# EAGLE design Supplemental Power Switch System (EAGLE 8.1.0)
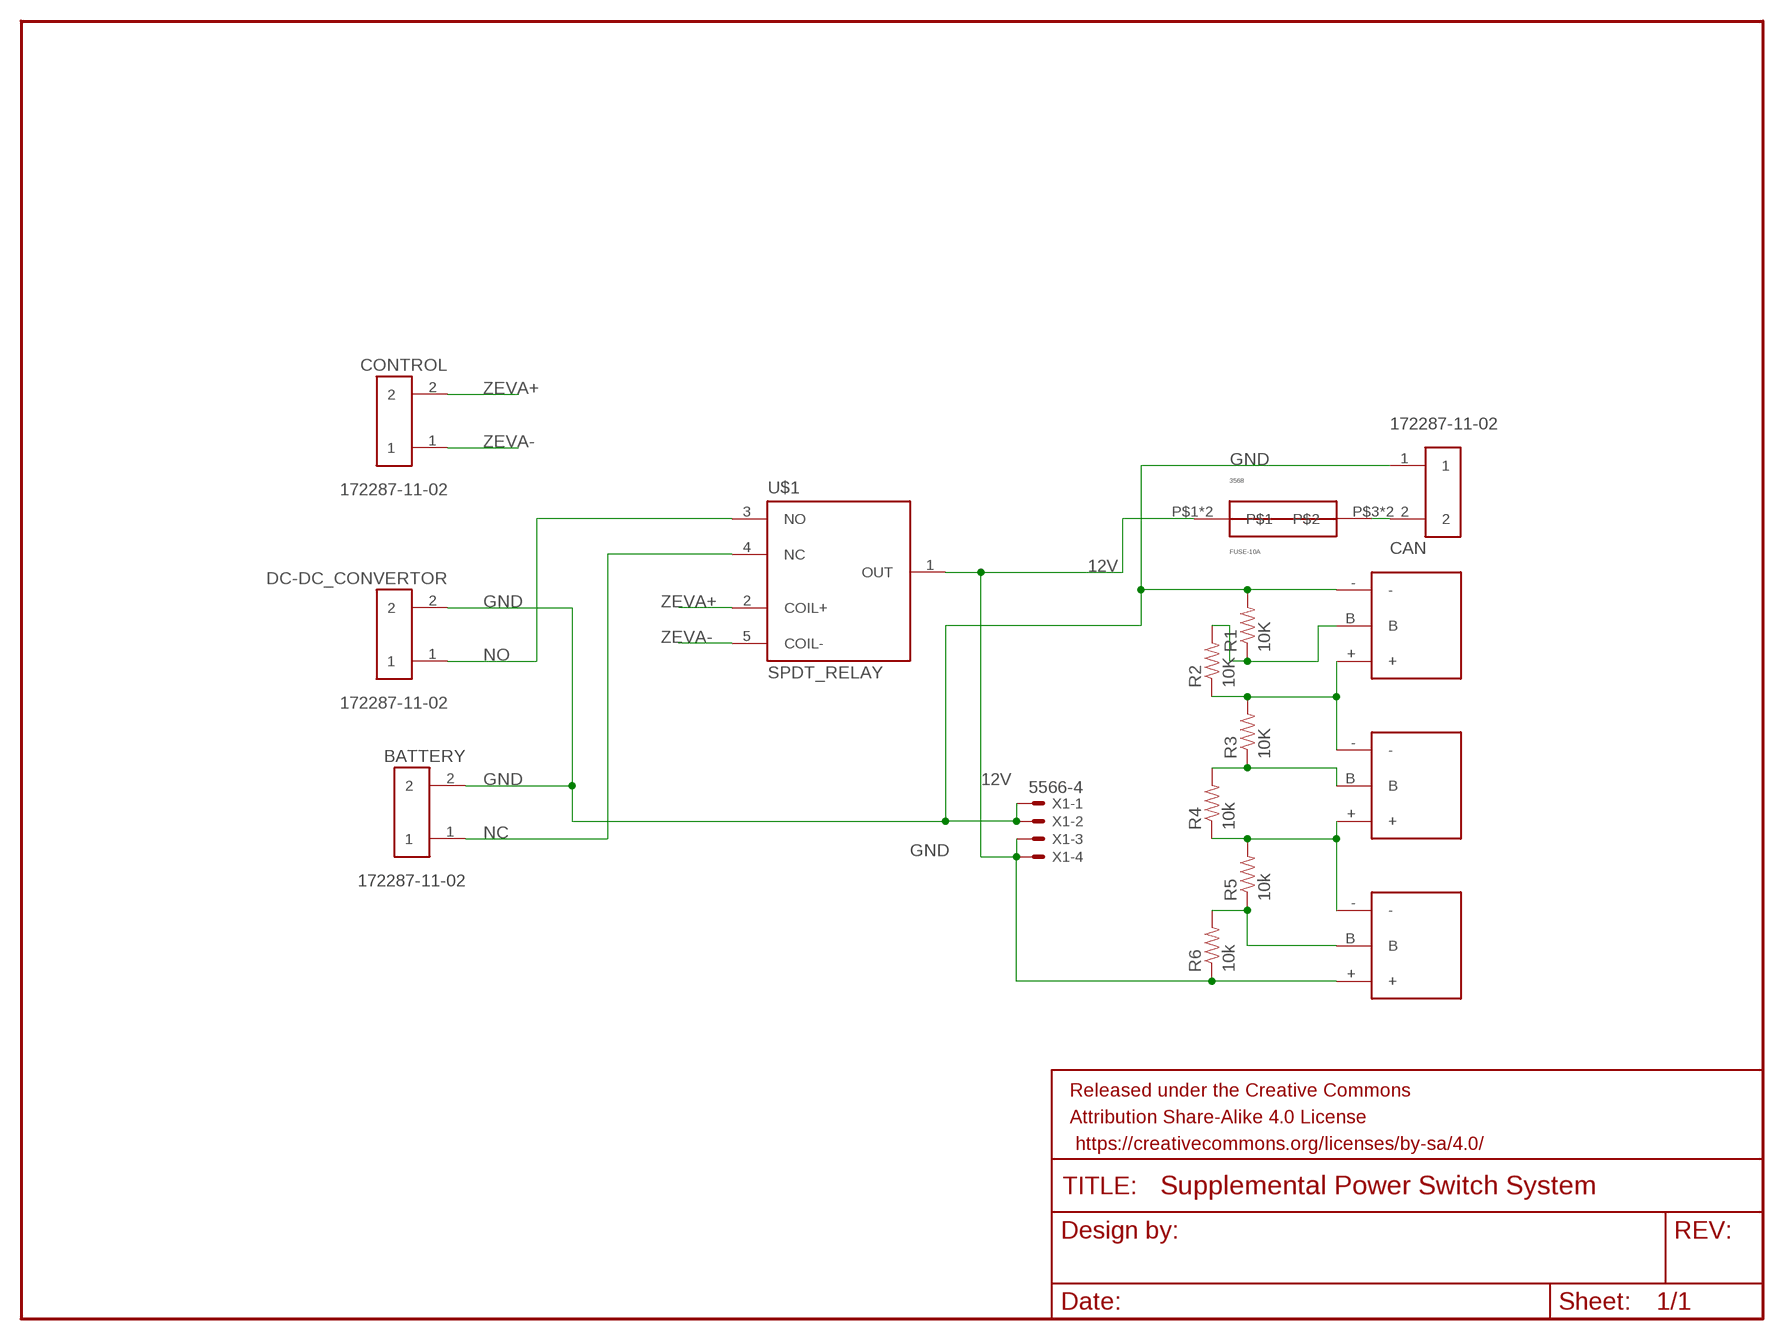
[diagram p0: schematic, sheet 1]

## Parts
BATTERY  172287-11-02  [172287-ULTRA-FIT]
C1  SUPER-CAPACITOR  [DMF]
C2  SUPER-CAPACITOR  [DMF]
C3  SUPER-CAPACITOR  [DMF]
CAN  172287-11-02  [172287-ULTRA-FIT]
CONTROL  172287-11-02  [172287-ULTRA-FIT]
DC-DC_CONVERTOR  172287-11-02  [172287-ULTRA-FIT]
FRAME1  FRAME-LETTERNO_PACKAGE  [DUMMY]
FUSE-10A  3568  [3568-MINI-297]
R1  10K  RESISTOR1206  [1206]
R2  10K  RESISTOR1206  [1206]
R3  10K  RESISTOR1206  [1206]
R4  10k  RESISTOR1206  [1206]
R5  10k  RESISTOR1206  [1206]
R6  10k  RESISTOR1206  [1206]
U$1  SPDT_RELAY  [G8QN-1C4]
X1  5566-4  [5566-4]

## Nets
12V: C3.+ FUSE-10A.P$1 FUSE-10A.P$2 R6.1 U$1.1(OUT) X1.3 X1.4
GND: BATTERY.2 C1.- CAN.1 DC-DC_CONVERTOR.2 R1.2 X1.1 X1.2
N$1: CAN.2 FUSE-10A.P$3 FUSE-10A.P$4
N$3: C3.B R5.1 R6.2
N$4: C2.+ C3.- R4.1 R5.2
N$5: C2.B R3.1 R4.2
N$6: C1.+ C2.- R2.1 R3.2
N$7: C1.B R1.1 R2.2
NC: BATTERY.1 U$1.4(NC)
NO: DC-DC_CONVERTOR.1 U$1.3(NO)
ZEVA+: CONTROL.2 U$1.2(COIL+)
ZEVA-: CONTROL.1 U$1.5(COIL-)

## Library data of the parts
BATTERY CAN CONTROL DC-DC_CONVERTOR = Hooman:172287-11-02: Ultra-Fit™ 172287 Header Molex 3.5 mm pitch 2 pin connector header
C1-C3 = Hooman:SUPER-CAPACITOR: Murata Super Capacitor DMF3Z5R5H474M3DTA0
FRAME1 = SparkFun-Aesthetics:FRAME-LETTER: Schematic Frame Standard 8.5x11 US Letter frame; DESIGNER: Nobody; VERSION: v01
FUSE-10A = Hooman:3568: MINI 296 fuse holder for MINI BLADE fuse https://www.digikey.ca/products/en?FV=ffec3ba1,ffe0008c
R1-R6 = SparkFun-Passives:RESISTOR: Resistor Basic schematic elements and footprints for 0603, 1206, and PTH resistors.
U$1 = Hooman:SPDT_RELAY: SPDT Relay
X1 = con-molex:5566-4: Mini FIT connector 4 pol Source: http://www.molex.com; OC_FARNELL: unknown; OC_NEWARK: unknown

## Board
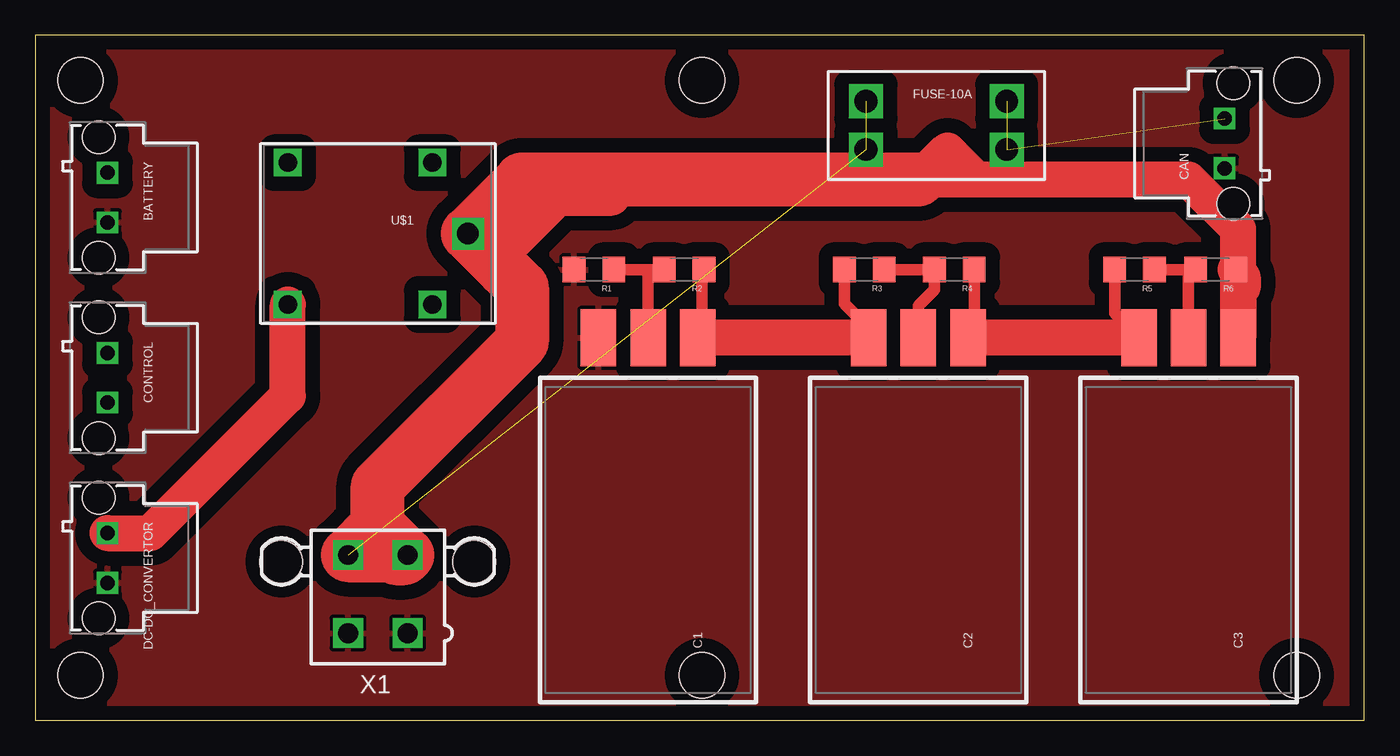
[diagram p1: board, top side]
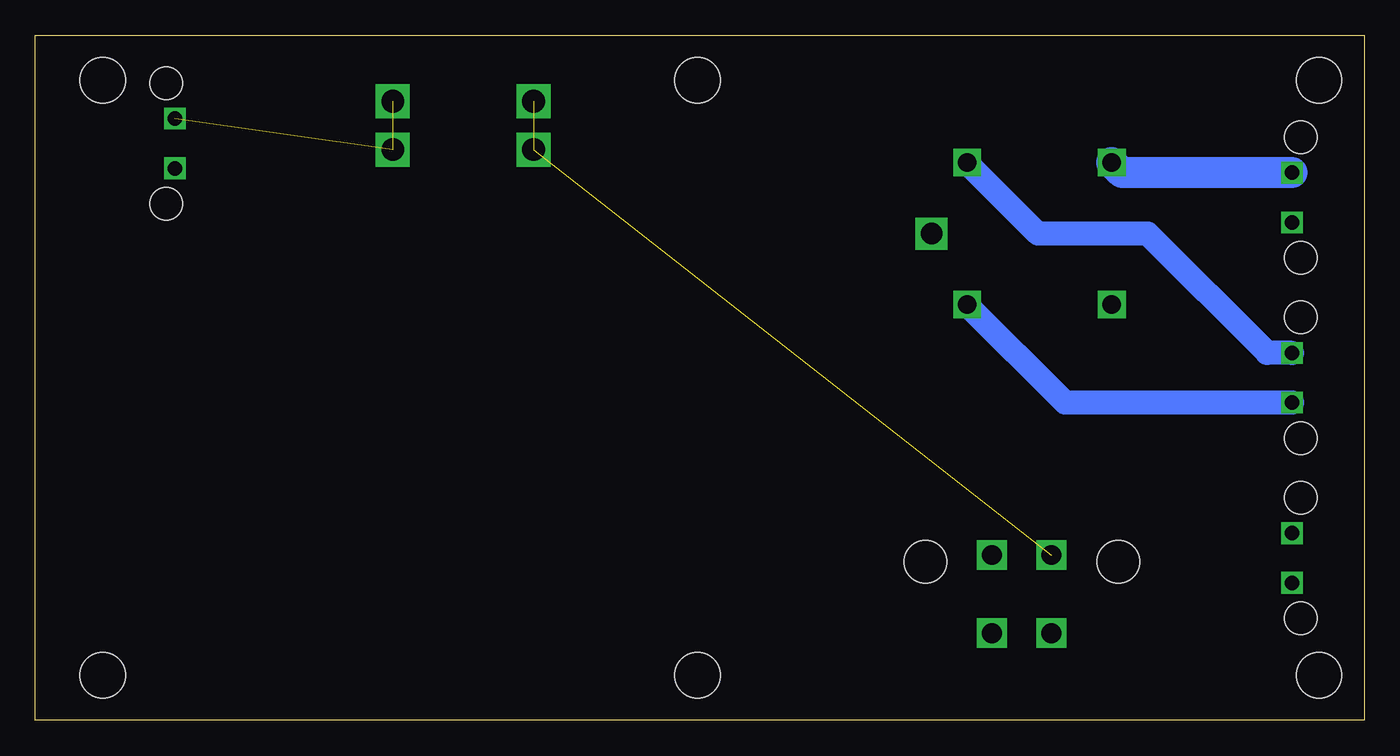
[diagram p2: board, bottom side, seen from below]

Size 93.65 x 48.25 mm. Coordinates in mm from the lower left corner, seen from the top.
Outline: 0,0 93.65,0 93.65,48.25 0,48.25 0,0
Copper layers (1*16): Top 0.035mm / dielectric 1.5mm / Bottom 0.035mm
Design rules "default": minimum track width 10mil, minimum drill 24mil, track to track 8mil, track to pad 8mil, pad to pad 8mil, via to via 8mil, smd to smd 8mil, copper to edge 40mil, drill to drill 8mil, minimum pad ring 10mil, minimum via ring 8mil, stop-mask expansion 4mil, vias tented up to drill 0mil, thermal gap 10mil
Holes 3.2 mm at 3.17,3.17 46.99,3.17 46.99,45.09 3.17,45.09 88.9,45.09 88.9,3.17

### Footprints (pad centres in the part's own frame; a part is rotated, then mirrored left to right if it is on the bottom)
172287-ULTRA-FIT = drill 1.02 square: 1 -1.75,0; 2 1.75,0 | hole 2.3: -4.25,-0.63; 4.25,-0.63
DMF = smd 4 x 2.5: + 14.25,-3.5; - 14.25,3.5; B 14.25,0
3568-MINI-297 = drill 1.6 square: P$1 4.96,1.7; P$2 4.96,-1.7; P$3 -4.96,1.7; P$4 -4.96,-1.7
1206 = smd 1.6 x 1.8: 1 -1.4,0; 2 1.4,0
G8QN-1C4 = drill 1.5 square: 1 -6.35,0 | drill 1.3 square: 2 -3.85,5; 3 6.35,5; 4 6.35,-5; 5 -3.85,-5
5566-4 = drill 1.4 square: 1 2.1,-2.75; 2 -2.1,-2.75; 3 2.1,2.75; 4 -2.1,2.75 | hole 3: 6.8,2.29; -6.8,2.29

### Placement (x,y rotation side)
BATTERY  5.08,36.83 270 top
C1  43.18,12.7 90 top
C2  62.23,12.7 90 top
C3  81.28,12.7 90 top
CAN  83.82,40.64 90 top
CONTROL  5.08,24.13 270 top
DC-DC_CONVERTOR  5.08,11.43 270 top
FRAME1  -13.97,15.24 0 top  (outside the outline)
FUSE-10A  63.5,41.91 180 top
R1  39.37,31.75 180 top
R2  45.72,31.75 180 top
R3  58.42,31.75 180 top
R4  64.77,31.75 180 top
R5  77.47,31.75 180 top
R6  83.19,31.75 180 top
U$1  24.13,34.29 180 top
X1  24.13,8.89 0 top

### Tracks (layer width: path | path; a pad name or v marks a point on that pad's centre or on a via)
12V  (2 unrouted)
  Top 2.54: R6.1 85.09,31.25 85.09,30.48 84.78,30.17 C3.+ 84.78,34.6 81.28,38.1 66.35,38.1 | 66.35,38.1 64.29,40.16 62.23,38.1 66.35,38.1 | 33.02,31.75 33.02,33.02 36.83,36.83 40.64,36.83
  Top 3.81: 24.13,13.74 24.13,16.51 34.29,26.67 34.29,30.48 33.02,31.75 U$1.1 34.29,38.1 62.23,38.1 | 24.13,13.74 X1.3 26.02,11.43 25.4,11.43 25.19,11.64 X1.4 24.13,13.74
GND
  pour Top (isolate 1.016): 0,48.26 92.71,48.26 92.71,0 0,0
N$1  (2 unrouted)
N$3
  Top 0.813: R5.1 R6.2 81.28,31.25 C3.B
N$4
  Top 0.813: R4.1 66.17,27.39 C2.+ | R5.2 76.07,28.66 C3.-
  Top 2.54: C3.- C2.+
N$5
  Top 0.813: R3.1 R4.2 63.37,30.35 62.23,29.21 C2.B
N$6
  Top 0.813: R2.1 46.99,31.75 46.99,27.94 46.68,27.94 C1.+ | R3.2 57.02,29.34 58.42,27.94 58.42,27.26 C2.-
  Top 2.54: C2.- C1.+
N$7
  Top 0.813: R1.1 R2.2 43.18,31.75 C1.B
NC
  Bottom 2.184: BATTERY.1 17.07,38.58 U$1.4
NO
  Top 2.54: DC-DC_CONVERTOR.1 8.1,13.18 17.78,22.86 U$1.3
ZEVA+
  Bottom 1.676: CONTROL.2 21.07,22.38 U$1.2
ZEVA-
  Bottom 1.676: CONTROL.1 6.83,25.88 15.24,34.29 22.98,34.29 U$1.5